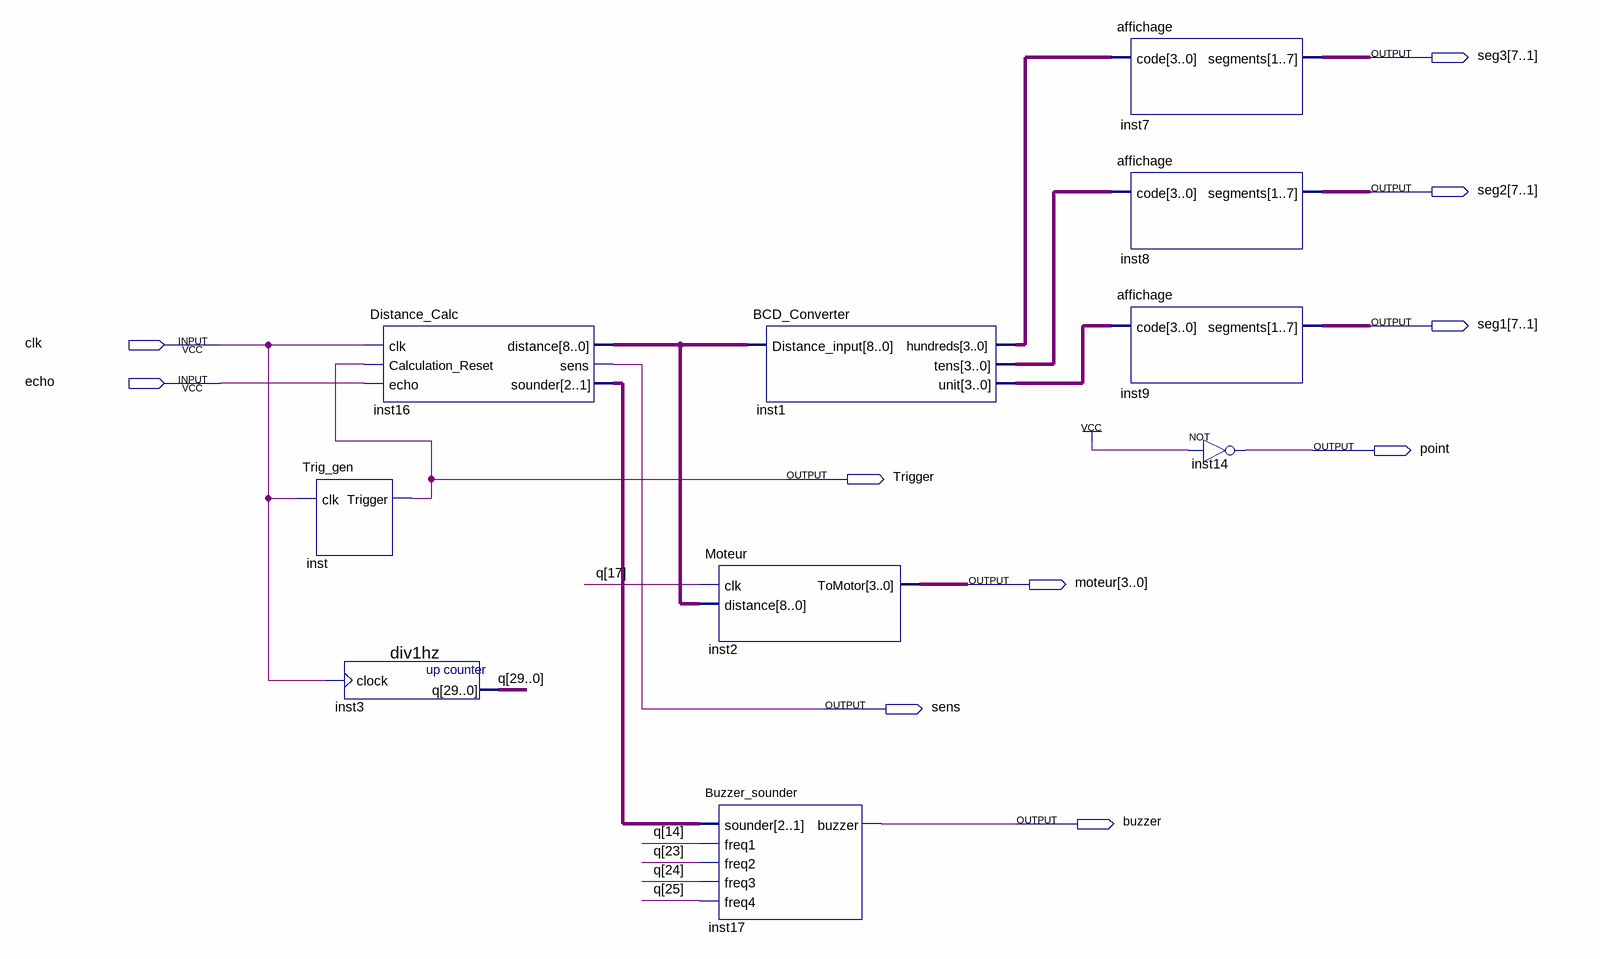
[diagram p0: schematic sheet]
// Quartus schematic Full_Capteur.bdf as structural Verilog: 10 symbols, 10 pins
module Full_Capteur (
  input  clk,
  input  echo,
  output [7:1] seg3,
  output [7:1] seg2,
  output [7:1] seg1,
  output point,
  output Trigger,
  output [3:0] moteur,
  output sens,
  output buzzer
);

  wire [1:0] inst16_sounder;
  wire [3:0] inst1_hundreds, inst1_tens, inst1_unit;
  wire [8:0] inst16_distance;
  wire [29:0] q;

  Trig_gen inst (.clk(clk), .Trigger(Trigger));
  div1hz inst3 (.clock(clk), .q(q));
  Distance_Calc inst16 (
    .clk(clk), .Calculation_Reset(Trigger), .echo(echo), .distance(inst16_distance), .sens(sens),
    .sounder(inst16_sounder));
  Moteur inst2 (.clk(q[17]), .distance(inst16_distance), .ToMotor(moteur));
  Buzzer_sounder inst17 (
    .sounder(inst16_sounder), .freq1(q[14]), .freq2(q[23]), .freq3(q[24]), .freq4(q[25]), .buzzer(buzzer));
  BCD_Converter inst1 (
    .Distance_input(inst16_distance), .hundreds(inst1_hundreds), .tens(inst1_tens), .unit(inst1_unit));
  affichage inst7 (.code(inst1_hundreds), .segments(seg3));
  affichage inst8 (.code(inst1_tens), .segments(seg2));
  affichage inst9 (.code(inst1_unit), .segments(seg1));
  not inst14 (point, 1'b1);
endmodule
